# EAGLE design canable (EAGLE 6.6.0)
Therm
CNAME: CANable USB<=>CAN / FabLab Karlsruhe MOD; CREVISION: 0.1; DESIGNER: Ethan Zonca
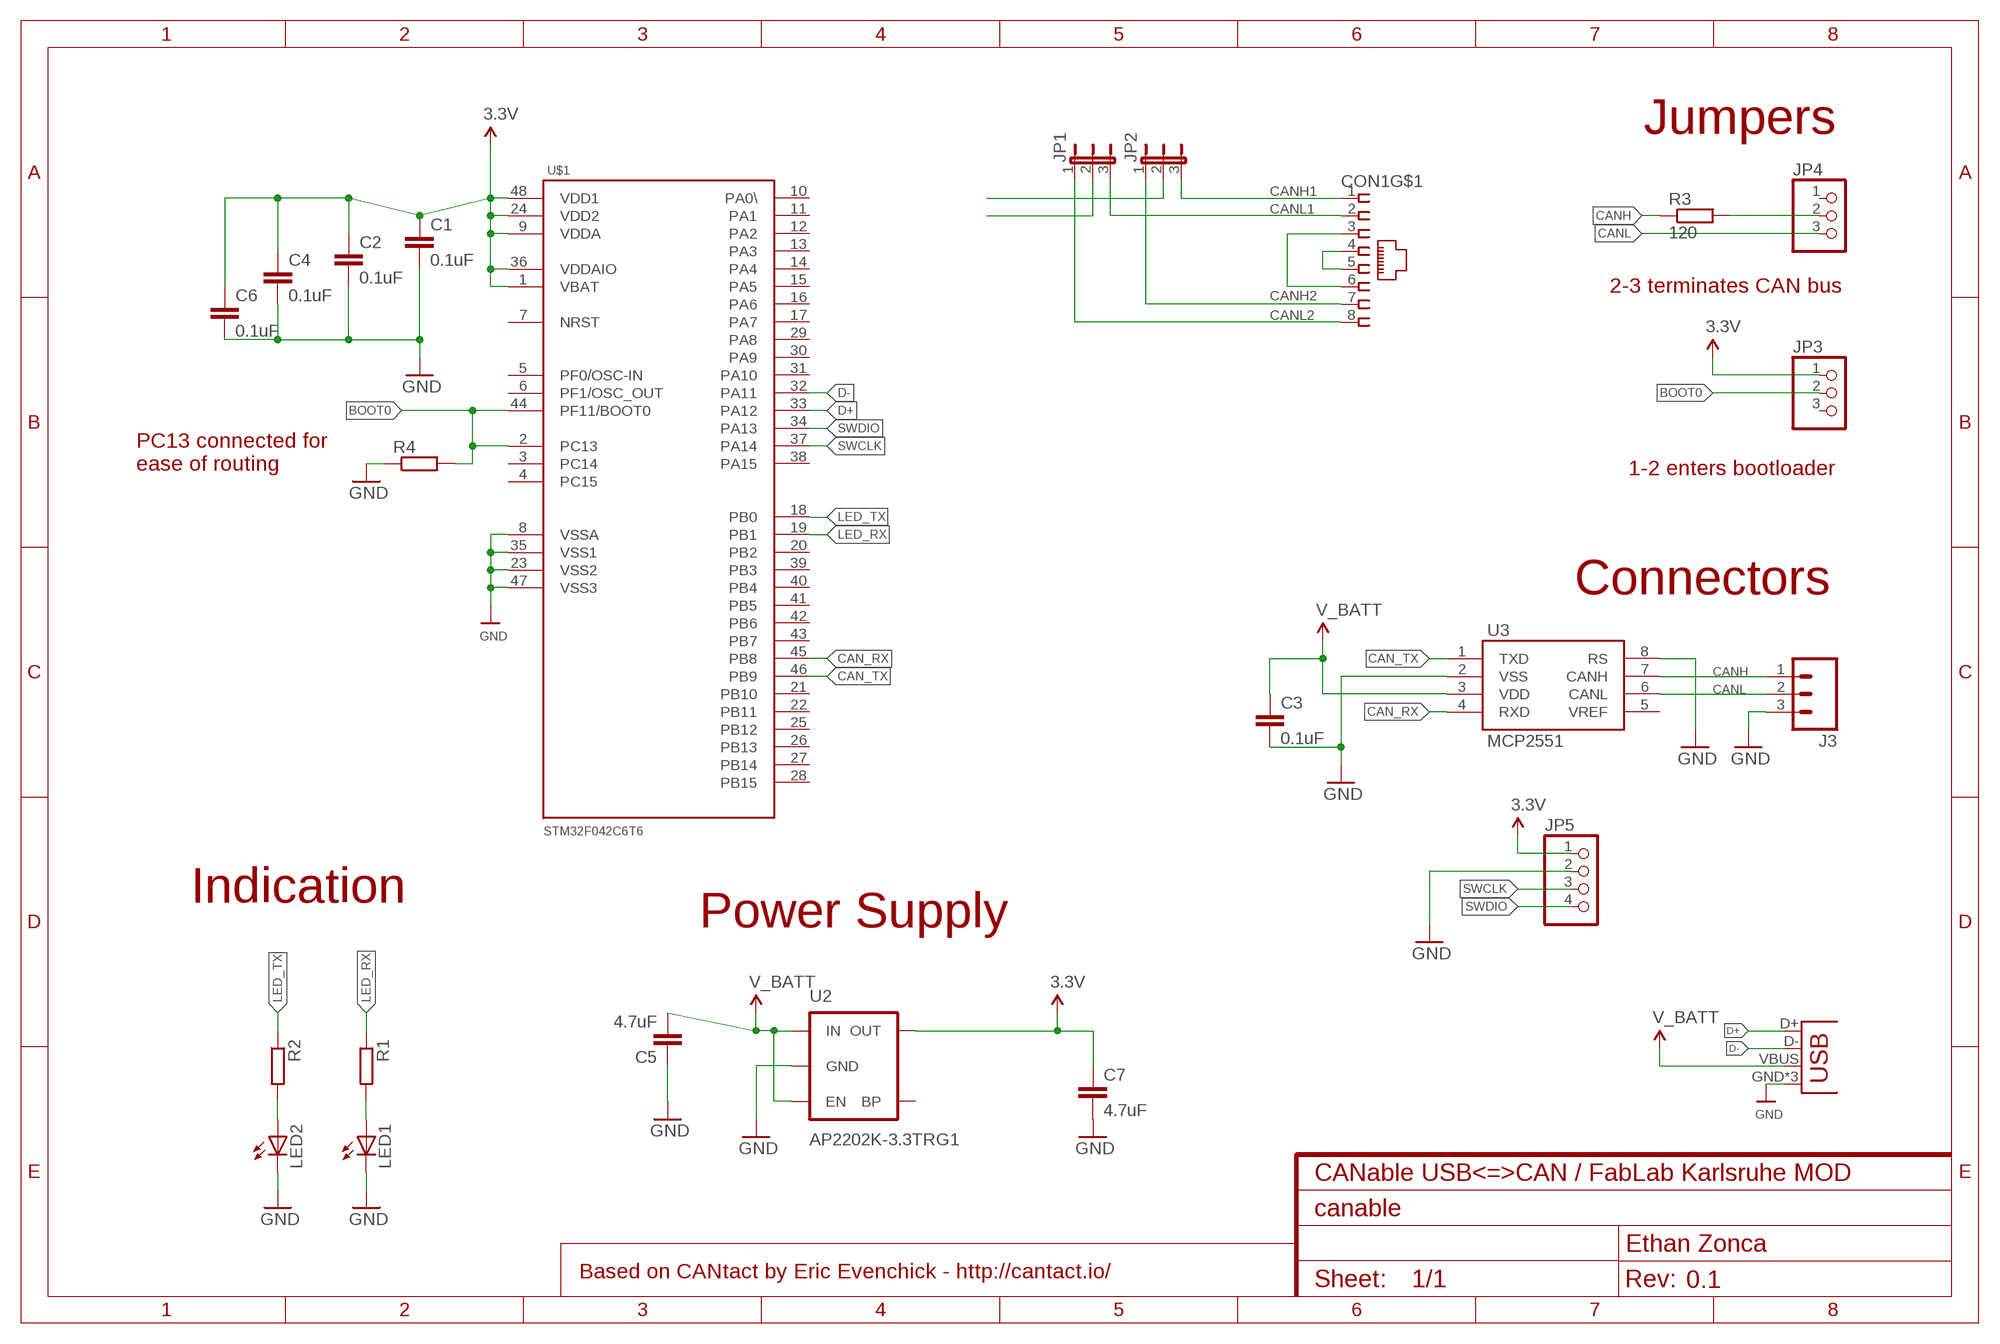
[diagram p0: schematic, sheet 1]

## Parts
C1  0.1uF  C-EUC0805  [C0805]
C2  0.1uF  C-EUC0805  [C0805]
C3  0.1uF  C-EUC0805  [C0805]
C4  0.1uF  C-EUC0805  [C0805]
C5  4.7uF  C-EUC0805  [C0805]
C6  0.1uF  C-EUC0805  [C0805]
C7  4.7uF  C-EUC0805  [C0805]
CON1  MEBP_8-8G  [MEBP]
J2  USB-MICROB  [USB-MICROB]
J3  M03SCREW_LOCK  [SCREWTERMINAL-3.5MM-3_LOCK.007S]
JP1  JP2E  [JP2]
JP2  JP2E  [JP2]
JP3  PINHD-1X3  [1X03]
JP4  PINHD-1X3  [1X03]
JP5  PINHD-1X4  [1X04]
LED1  LEDCHIPLED_1206  [CHIPLED_1206]
LED2  LEDCHIPLED_1206  [CHIPLED_1206]
R1  R-EU_R0805  [R0805]
R2  R-EU_R0805  [R0805]
R3  120  R-EU_R0805  [R0805]
R4  R-EU_R0805  [R0805]
U2  AP2202K-3.3TRG1  MIC52053.3V  [SOT23-5]
U3  MCP2551  [SO08]
U$1  STM32F042C6T6  [LQFP48]

## Nets
3.3V: C1.1 C2.1 C4.1 C6.1 C7.1 JP3.1 JP5.1 U2.5(OUT) U$1.1(VBAT) U$1.9(VDDA) U$1.24(VDD2) U$1.36(VDDAIO) U$1.48(VDD1)
BOOT0: JP3.2 R4.2 U$1.2(PC13) U$1.44(PF11/BOOT0)
CAN_RX: U3.4(RXD) U$1.45(PB8)
CAN_TX: U3.1(TXD) U$1.46(PB9)
CANH: J3.1 JP2.2 R3.1 U3.7(CANH)
CANH1: CON1.1 JP2.3
CANH2: CON1.7 JP2.1
CANL: J3.2 JP1.2 JP4.3 U3.6(CANL)
CANL1: CON1.2 JP1.3
CANL2: CON1.8 JP1.1
D+: J2.D+ U$1.33(PA12)
D-: J2.D- U$1.32(PA11)
GND: C1.2 C2.2 C3.2 C4.2 C5.1 C6.2 C7.2 J2.GND J2.MT1(GND) J2.MT2(GND) J3.3 JP5.2 LED1.C LED2.C R4.1 U2.2(GND) U3.2(VSS) U3.8(RS) U$1.8(VSSA) U$1.23(VSS2) U$1.35(VSS1) U$1.47(VSS3)
LED_RX: R1.1 U$1.19(PB1)
LED_TX: R2.1 U$1.18(PB0)
N$1: CON1.3 CON1.6
N$2: LED2.A R2.2
N$3: JP4.2 R3.2
N$4: CON1.4 CON1.5
N$23: LED1.A R1.2
SWCLK: JP5.3 U$1.37(PA14)
SWDIO: JP5.4 U$1.34(PA13)
V_BATT: C3.1 C5.2 J2.VBUS U2.1(IN) U2.3(EN) U3.3(VDD)
Unconnected: JP3.3 JP4.1 U2.4(BP) U3.5(VREF) U$1.3(PC14) U$1.4(PC15) U$1.5(PF0/OSC-IN) U$1.6(PF1/OSC_OUT) U$1.7(NRST) U$1.10(PA0\) U$1.11(PA1) U$1.12(PA2) U$1.13(PA3) U$1.14(PA4) U$1.15(PA5) U$1.16(PA6) U$1.17(PA7) U$1.20(PB2) U$1.21(PB10) U$1.22(PB11) U$1.25(PB12) U$1.26(PB13) U$1.27(PB14) U$1.28(PB15) U$1.29(PA8) U$1.30(PA9) U$1.31(PA10) U$1.38(PA15) U$1.39(PB3) U$1.40(PB4) U$1.41(PB5) U$1.42(PB6) U$1.43(PB7)

## Notes on the sheet
- Jumpers
- 2-3 terminates CAN bus
- 1-2 enters bootloader
- PC13 connected for
  ease of routing
- Connectors
- Indication
- Power Supply
- Based on CANtact by Eric Evenchick - http://cantact.io/

## Power pins joined to a net without a drawn wire
FGND: CON1.T1(FGND) CON1.T2(FGND)

## Library data of the parts
C1-C7 = schlager_passiv:C-EU: CAPACITOR, European symbol
CON1 = myconn:MEBP_8-8G: Reichelt RJ45 geschirmt MEBP 8-8G
J2 = SparkFun-Connectors:USB: USB Connectors USB-B-PTH is fully proven SKU : PRT-00139/CONN-08278 USB-miniB is fully proven SKU : PRT-00587 USB-A-PCB is untested. USB-A-H is throughly reviewed, but untested. Spark Fun Electronics SKU : PRT-00437 USB-B-SMT is throughly reviewed, but untested. Needs silkscreen touching up. USB-A-S has not been used/tested USB-MB-H has not been used/tested USB-MICROB has been used. CONN-09505; PROD_ID: CONN-09505
J3 = SparkFun-Connectors:M03: Header 3 Standard 3-pin 0.1" header. Use with straight break away headers (SKU : PRT-00116), right angle break away headers (PRT-00553), swiss pins (PRT-00743), machine pins (PRT-00117), and female headers (PRT-00115). Molex polarized connector foot print use with SKU : PRT-08232 with associated crimp pins and housings.
JP1 JP2 = jumper:JP2E: JUMPER
JP3 JP4 = pinhead:PINHD-1X3: PIN HEADER
JP5 = pinhead:PINHD-1X4: PIN HEADER
LED1 LED2 = led:LED: LED OSRAM: - CHIPLED LG R971, LG N971, LY N971, LG Q971, LY Q971, LO R971, LY R971 LH N974, LH R974 LS Q976, LO Q976, LY Q976 LO Q996 - Hyper CHIPLED LW Q18S LB Q993, LB Q99A, LB R99A - SideLED LS A670, LO A670, LY A670, LG A670, LP A670 LB A673, LV A673, LT A673, LW A673 LH A674 LY A675 LS A676, LA A676, LO A676, LY A676, LW A676 LS A679, LY A679, LG A679 - Hyper Micro SIDELED® LS Y876, LA Y876, LO Y876, LY Y876 LT Y87S - SmartLED LW L88C, LW L88S LB L89C, LB L89S, LG L890 LS L89K, LO L89K, LY L89K LS L896, LA L896, LO L896, LY L896 - TOPLED LS T670, LO T670, LY T670, LG T670, LP T670 LSG T670, LSP T670, LSY T670, LOP T670, LYG T670 LG T671, LOG T671, LSG T671 LB T673, LV T673, LT T673, LW T673 LH T674 LS T676, LA T676, LO T676, LY T676, LB T676, LH T676, LSB T676, LW T676 LB T67C, LV T67C, LT T67C, LS T67K, LO T67K, LY T67K, LW E67C LS E67B, LA E67B, LO E67B, LY E67B, LB E67C, LV E67C, LT E67C LW T67C LS T679, LY T679, LG T679 LS T770, LO T770, LY T770, LG T770, LP T770 LB T773, LV T773, LT T773, LW T773 LH T774 LS E675, LA E675, LY E675, LS T675 LS T776, LA T776, LO T776, LY T776, LB T776 LHGB T686 LT T68C, LB T68C - Hyper Mini TOPLED® LB M676 - Mini TOPLED Santana® LG M470 LS M47K, LO M47K, LY M47K Source: http://www.osram.convergy.de LUXEON: - LUMILED® LXK2-PW12-R00, LXK2-PW12-S00, LXK2-PW14-U00, LXK2-PW14-V00 LXK2-PM12-R00, LXK2-PM12-S00, LXK2-PM14-U00 LXK2-PE12-Q00, LXK2-PE12-R00, LXK2-PE12-S00, LXK2-PE14-T00, LXK2-PE14-U00 LXK2-PB12-K00, LXK2-PB12-L00, LXK2-PB12-M00, LXK2-PB14-N00, LXK2-PB14-P00, LXK2-PB14-Q00 LXK2-PR12-L00, LXK2-PR12-M00, LXK2-PR14-Q00, LXK2-PR14-R00 LXK2-PD12-Q00, LXK2-PD12-R00, LXK2-PD12-S00 LXK2-PH12-R00, LXK2-PH12-S00 LXK2-PL12-P00, LXK2-PL12-Q00, LXK2-PL12-R00 Source: www.luxeon.com KINGBRIGHT: KA-3528ASYC Source: www.kingbright.com
R1-R4 = schlager_passiv:R-EU_: RESISTOR, European symbol
U2 = SparkFun-PowerIC:MIC5205: MIC5205 150mA vreg 3.3V - VREG-00822 5V - VREG-00823; PROD_ID: VREG-00822
U3 = SparkFun-DigitalIC:MCP2551: CAN transceiver; PROD_ID: IC-09907
U$1 = Protofusion:STM32F042C6T6

## Board
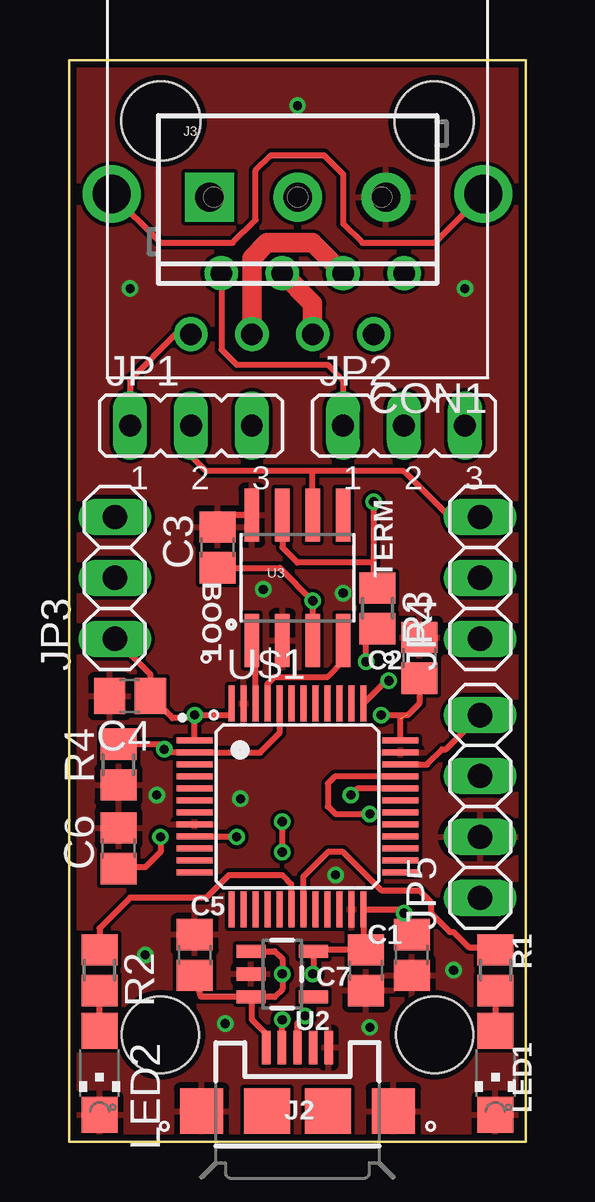
[diagram p1: board, top side]
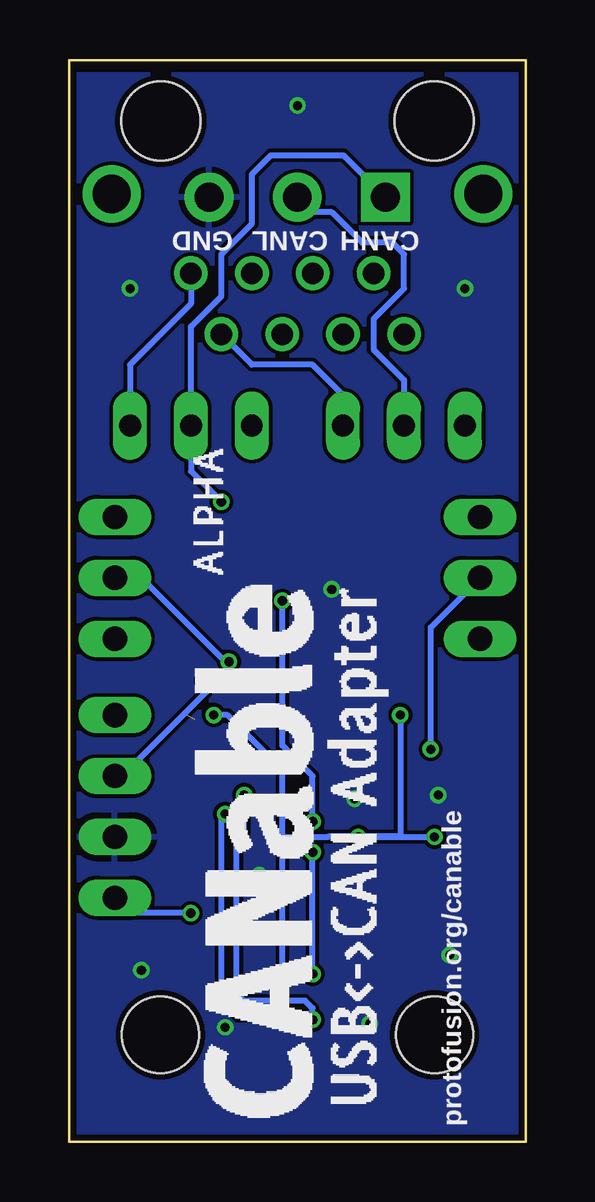
[diagram p2: board, bottom side, seen from below]

Size 19.05 x 45.09 mm. Coordinates in mm from the lower left corner, seen from the top.
Outline: 0,0 0,45.09 19.05,45.09 19.05,0 0,0
Copper layers (1*16): Top 0.035mm / dielectric 1.5mm / Bottom 0.035mm
Design rules "Elecrow_2-layer_eagle_rule *": minimum track width 6mil, minimum drill 12mil, track to track 6mil, track to pad 6mil, pad to pad 6mil, via to via 6mil, smd to smd 0mil, copper to edge 10mil, drill to drill 10mil, minimum pad ring 10mil, minimum via ring 6mil, stop-mask expansion 2mil, vias tented up to drill 100mil, thermal gap 10mil
Holes 3.2 mm at 3.81,4.45 15.24,4.45

### Footprints (pad centres in the part's own frame; a part is rotated, then mirrored left to right if it is on the bottom)
C0805 = smd 1.3 x 1.5: 1 -0.85,0; 2 0.85,0
MEBP = drill 0.9: 1 -4.445,6.35; 2 -3.175,8.89; 3 -1.9,6.35; 4 -0.635,8.89; 5 0.635,6.35; 6 1.9,8.89; 7 3.175,6.35; 8 4.445,8.89 | drill 1.6: T1 -7.75,3.05; T2 7.75,3.05 | hole 3.3: -5.7,0; 5.7,0
USB-MICROB = smd 0.35 x 1.4: D+ 0,2.65; D- -0.65,2.65; GND 1.3,2.65; ID 0.65,2.65; VBUS -1.3,2.65 | smd 1.8 x 1.9: MT1 -4,0; MT2 4,0 | smd 1.9 x 1.9: P$1 -1.27,0; P$2 1.27,0
SCREWTERMINAL-3.5MM-3_LOCK.007S = drill 1.2 pad 2.032 square: 1 -0.178,0 | drill 1.2 pad 2.032: 2 3.5,0; 3 7.178,0
JP2 = drill 0.914 long: 1 -2.54,0; 2 0,0; 3 2.54,0
1X03 = drill 1.016 long: 1 -2.54,0; 2 0,0; 3 2.54,0
1X04 = drill 1.016 long: 1 -3.81,0; 2 -1.27,0; 3 1.27,0; 4 3.81,0
CHIPLED_1206 = smd 1.5 x 1.5: A 0,-1.75; C 0,1.75
R0805 = smd 1.3 x 1.5: 1 -0.85,0; 2 0.85,0
SOT23-5 = smd 0.55 x 1.2: 1 -0.95,-1.3; 2 0,-1.3; 3 0.95,-1.3; 4 0.95,1.3; 5 -0.95,1.3
SO08 = smd 0.61 x 2.21: 1 -1.905,-2.616; 2 -0.635,-2.616; 3 0.635,-2.616; 4 1.905,-2.616; 5 1.905,2.616; 6 0.635,2.616; 7 -0.635,2.616; 8 -1.905,2.616
LQFP48 = smd 1.5 x 0.25: 1 -4.3,2.75; 2 -4.3,2.25; 3 -4.3,1.75; 4 -4.3,1.25; 5 -4.3,0.75; 6 -4.3,0.25; 7 -4.3,-0.25; 8 -4.3,-0.75; 9 -4.3,-1.25; 10 -4.3,-1.75; 11 -4.3,-2.25; 12 -4.3,-2.75; 25 4.3,-2.75; 26 4.3,-2.25; 27 4.3,-1.75; 28 4.3,-1.25; 29 4.3,-0.75; 30 4.3,-0.25; 31 4.3,0.25; 32 4.3,0.75; 33 4.3,1.25; 34 4.3,1.75; 35 4.3,2.25; 36 4.3,2.75 | smd 0.25 x 1.5: 13 -2.75,-4.3; 14 -2.25,-4.3; 15 -1.75,-4.3; 16 -1.25,-4.3; 17 -0.75,-4.3; 18 -0.25,-4.3; 19 0.25,-4.3; 20 0.75,-4.3; 21 1.25,-4.3; 22 1.75,-4.3; 23 2.25,-4.3; 24 2.75,-4.3; 37 2.75,4.3; 38 2.25,4.3; 39 1.75,4.3; 40 1.25,4.3; 41 0.75,4.3; 42 0.25,4.3; 43 -0.25,4.3; 44 -0.75,4.3; 45 -1.25,4.3; 46 -1.75,4.3; 47 -2.25,4.3; 48 -2.75,4.3

### Placement (x,y rotation side)
C1  14.29,7.78 270 top
C2  14.61,20.16 90 top
C3  6.19,24.77 90 top
C4  2.54,18.57 180 top
C5  5.24,7.78 270 top
C6  2.06,12.22 90 top
C7  12.38,7.14 270 top
CON1  9.53,42.55 180 top
J2  9.53,1.27 0 top
J3  6.03,39.37 0 top
JP1  5.08,29.84 0 top
JP2  13.97,29.84 0 top
JP3  1.91,23.5 90 top
JP4  17.14,23.5 90 top
JP5  17.14,13.97 90 top
LED1  17.78,2.86 180 top
LED2  1.27,2.86 180 top
R1  17.78,7.14 270 top
R2  1.27,7.14 270 top
R3  12.86,22.23 270 top
R4  2.06,15.72 90 top
U2  8.89,6.99 270 top
U3  9.53,23.5 0 top
U$1  9.53,13.97 0 top
U$2  [CANABLE-LOGO]  6.35,1.91 90 bottom

### Tracks (layer width: path | path; a pad name or v marks a point on that pad's centre or on a via)
3.3V  (via drill 0.38)  (1 unrouted)
  Top 0.254: v10.16,6.99 10.19,7.01 U2.5 10.25,7.99 C7.1 12.28,8.1 U$1.24 13.82,9.67 v13.97,9.53 13.97,8.47 C1.1 | U$1.36 13.82,17.62 | v13.02,17.78 14.13,17.78 14.61,18.26 C2.1 | 5.09,17.78 v5.24,17.78 | v5.24,17.78 6.67,17.78 6.78,17.89 U$1.48 | v3.81,12.7 3.81,12.06 3.17,11.43 2.12,11.43 C6.1 | JP3.1 3.39,19.47 C4.1 4.31,17.65 5.22,17.65 U$1.1 5.22,17.77 v5.24,17.78 | U$1.9 6.96,12.72 v6.99,12.7
  Bottom 0.254: 10.16,12.7 8.26,12.7 | v3.81,12.7 v6.99,12.7 8.26,12.7 | v10.16,6.99 10.16,12.7 | 8.26,12.7 8.23,12.72 U$1.9 5.24,12.73 v5.24,17.78 | 10.16,12.7 10.16,15.49 12.45,17.78 v13.02,17.78 | v13.97,9.53 16.51,9.53 JP5.1
BOOT0  (via drill 0.38)
  Top 0.254: U$1.44 8.78,17.03 7.96,16.22 U$1.2 4.1,16.22 v3.97,16.35 3.75,16.57 R4.2
  Bottom 0.254: v3.97,16.35 3.97,21.43 JP3.2
CAN_RX
  Top 0.254: U3.4 11.43,20 10.79,19.37 8.57,19.37 8.28,19.07 U$1.45
CAN_TX
  Top 0.254: U$1.46 7.78,21.43 7.62,21.59 U3.1
CANH  (via drill 0.38)
  Top 0.254: U3.7 8.89,24.77 9.53,24.13 12.7,24.13 | v12.7,26.67 12.7,24.13 | 12.7,24.13 12.7,23.23 R3.1
  Bottom 0.254: v12.7,26.67 13.97,27.94 JP2.2 13.97,33.97 12.7,35.24 12.7,36.99 11.43,38.26 11.43,40.32 10.64,41.12 7.6,41.12 J3.1
CANH1
  Bottom 0.254: CON1.1 13.97,34.92 16.51,32.38 JP2.3
CANH2
  Top 0.254: CON1.7 6.35,33.02 6.99,32.38 10.79,32.38 11.43,31.75 JP2.1
CANL
  Top 0.254: JP4.3 15.88,26.04 13.97,27.94 10.16,27.94 | 10.16,27.94 5.71,27.94 5.08,28.57 JP1.2 | U3.6 10.16,27.94
  Bottom 0.254: JP1.2 5.08,31.75 6.35,33.02 6.35,34.29 5.08,35.56 5.08,36.99 5.56,37.47 6.83,37.47 8.1,38.73 8.9,38.73 J3.2
CANL1
  Bottom 0.254: JP1.3 7.62,31.11 8.89,32.38 11.43,32.38 CON1.2
CANL2
  Top 0.254: CON1.8 4.45,33.66 2.54,31.75 JP1.1
D+  (via drill 0.38)
  Top 0.254: J2.D+ 9.53,4.92 v9.84,5.24 | U$1.33 11.09,15.22 10.79,14.92 10.79,13.97 11.11,13.65 v12.54,13.65
  Bottom 0.254: v9.84,5.24 12,5.24 12.7,5.94 12.7,13.49 v12.54,13.65
D-  (via drill 0.38)
  Top 0.254: J2.D- 8.88,5.08 v8.89,5.08 | U$1.32 12.02,14.72 v11.75,14.45
  Bottom 0.254: v8.89,5.08 8.89,5.56 9.21,5.87 11.75,5.87 12.06,6.19 12.06,12.54 11.75,12.86 v11.75,14.45
FGND
  Top 0.254: CON1.T2 3.81,37.47 6.83,37.47 7.78,38.42 7.78,40.48 8.41,41.12 10.64,41.12 11.43,40.32 11.43,38.26 12.22,37.47 15.24,37.47 CON1.T1
GND  (via drill 0.38)
  Top 0.254: U3.8 6.69,26.11 C3.2
  other vias: 16.03,7.14 6.51,4.92 11.43,22.86 7.14,14.29 3.65,14.45 3.17,7.78 11.11,11.11 16.51,35.56 2.54,35.56 9.53,43.18 8.1,23.02 12.54,4.76
  pour Bottom: 0,44.45 21.59,44.45 21.59,-3.81 0,-3.81
  pour Top: -1.27,-0.64 22.86,-0.64 22.86,45.09 -1.27,45.09
LED_RX
  Top 0.254: U$1.19 9.78,11.04 10.79,12.06 11.43,12.06 13.02,10.48 14.61,10.48 15.08,10 15.08,9.53 15.88,8.73 16.03,8.73 16.67,8.1 17.68,8.1 R1.1
LED_TX
  Top 0.254: U$1.18 9.28,10.73 8.89,11.11 6.65,11.11 6.65,11.1 5.71,10.16 2.54,10.16 1.27,8.89 R2.1
N$1
  Top 0.813: CON1.6 7.62,36.84 8.26,37.47 10.15,37.47 CON1.3
N$2
  Top 0.254: LED2.A R2.2
N$3  (via drill 0.38)
  Top 0.254: v12.38,20 12.38,20.9 R3.2
  Bottom 0.254: v12.38,20 12.54,20 15.72,23.18 16.83,23.18 JP4.2
N$4
  Top 0.813: CON1.4 10.16,34.92 CON1.5
N$23
  Top 0.254: R1.2 LED1.A
SWCLK  (via drill 0.38)
  Top 0.254: v13.34,19.21 13.21,19.21 U$1.37
  Bottom 0.254: JP5.3 16.83,15.24 13.34,18.73 v13.34,19.21
SWDIO
  Top 0.254: U$1.34 14.93,15.72 15.56,16.35 15.72,16.35 JP5.4
V_BATT  (via drill 0.38)
  Top 0.254: U2.3 5.5,6.04 C5.2 | U2.1 8.57,7.93 8.89,7.62 v8.89,6.99 8.89,6.35 8.57,6.03 U2.3 | J2.VBUS 8.22,4.47 7.62,5.08 7.62,6 U2.3 | v8.89,12.06 v8.89,13.34 | U3.3 v10.16,22.54 8.79,23.91 C3.1
  Bottom 0.254: v8.89,6.99 v8.89,12.06 | v8.89,13.34 8.89,15.24 10.16,16.51 v10.16,22.54

### Text on the board
tPlace: BOOT | TERM
bPlace: CANH | CANL | GND | protofusion.org/canable